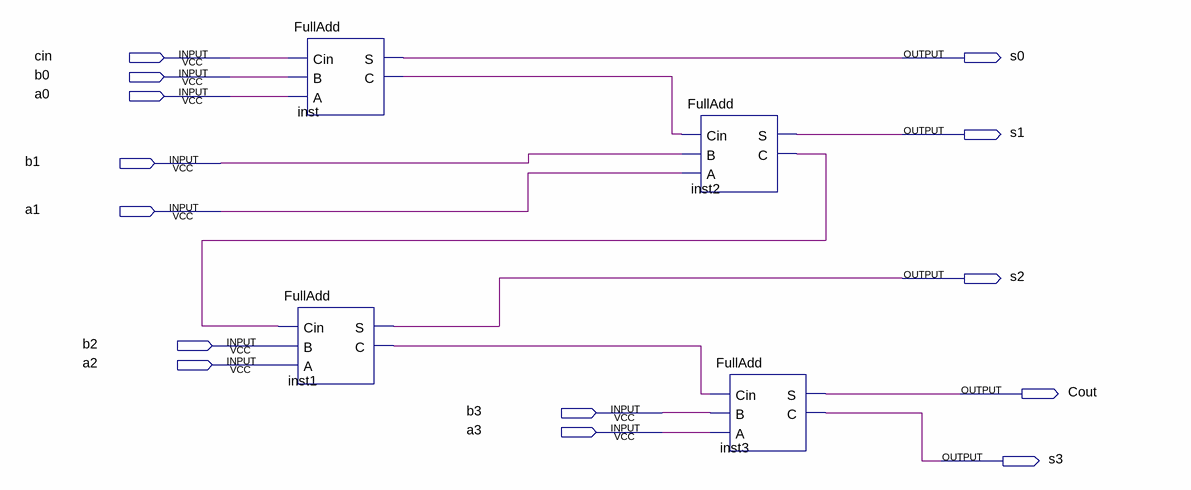
[diagram p0: schematic sheet]
// Quartus schematic FourAdd.bdf as structural Verilog: 4 symbols, 14 pins
module FourAdd (
  input  cin,
  input  b0,
  input  a0,
  input  b1,
  input  a1,
  input  b2,
  input  a2,
  input  b3,
  input  a3,
  output s0,
  output s1,
  output s2,
  output Cout,
  output s3
);

  wire inst1_c, inst2_c, inst_c;

  FullAdd inst (.Cin(cin), .B(b0), .A(a0), .S(s0), .C(inst_c));
  FullAdd inst1 (.Cin(inst2_c), .B(b2), .A(a2), .S(s2), .C(inst1_c));
  FullAdd inst2 (.Cin(inst_c), .B(b1), .A(a1), .S(s1), .C(inst2_c));
  FullAdd inst3 (.Cin(inst1_c), .B(b3), .A(a3), .S(Cout), .C(s3));
endmodule
